# Altium schematic sheet 08_PowerConcept.SchDoc: -
size A3; Date: -; ApprovedBy: -; CheckedBy: -; Author: -; CompanyName: -; DrawnBy: -; Engineer: -; Organization: Komax AG; Address1: -; Address2: -; Address3: -; Address4: -; DocumentNumber: -; Revision: -; SheetNumber: 8; SheetTotal: 8; KSDP_ObjectName: Power Concept; KSDP_CreatedBy: Patrick Rossacher; KSDP_CreationDate: 14.11.2018; KSDP_ModificationDate: -; KSDP_ModifiedBy: -; CurrentTime: -; CurrentDate: -; Time: -; DocumentFullPathAndName: -; DocumentName: -; ModifiedDate: -; ImagePath: -
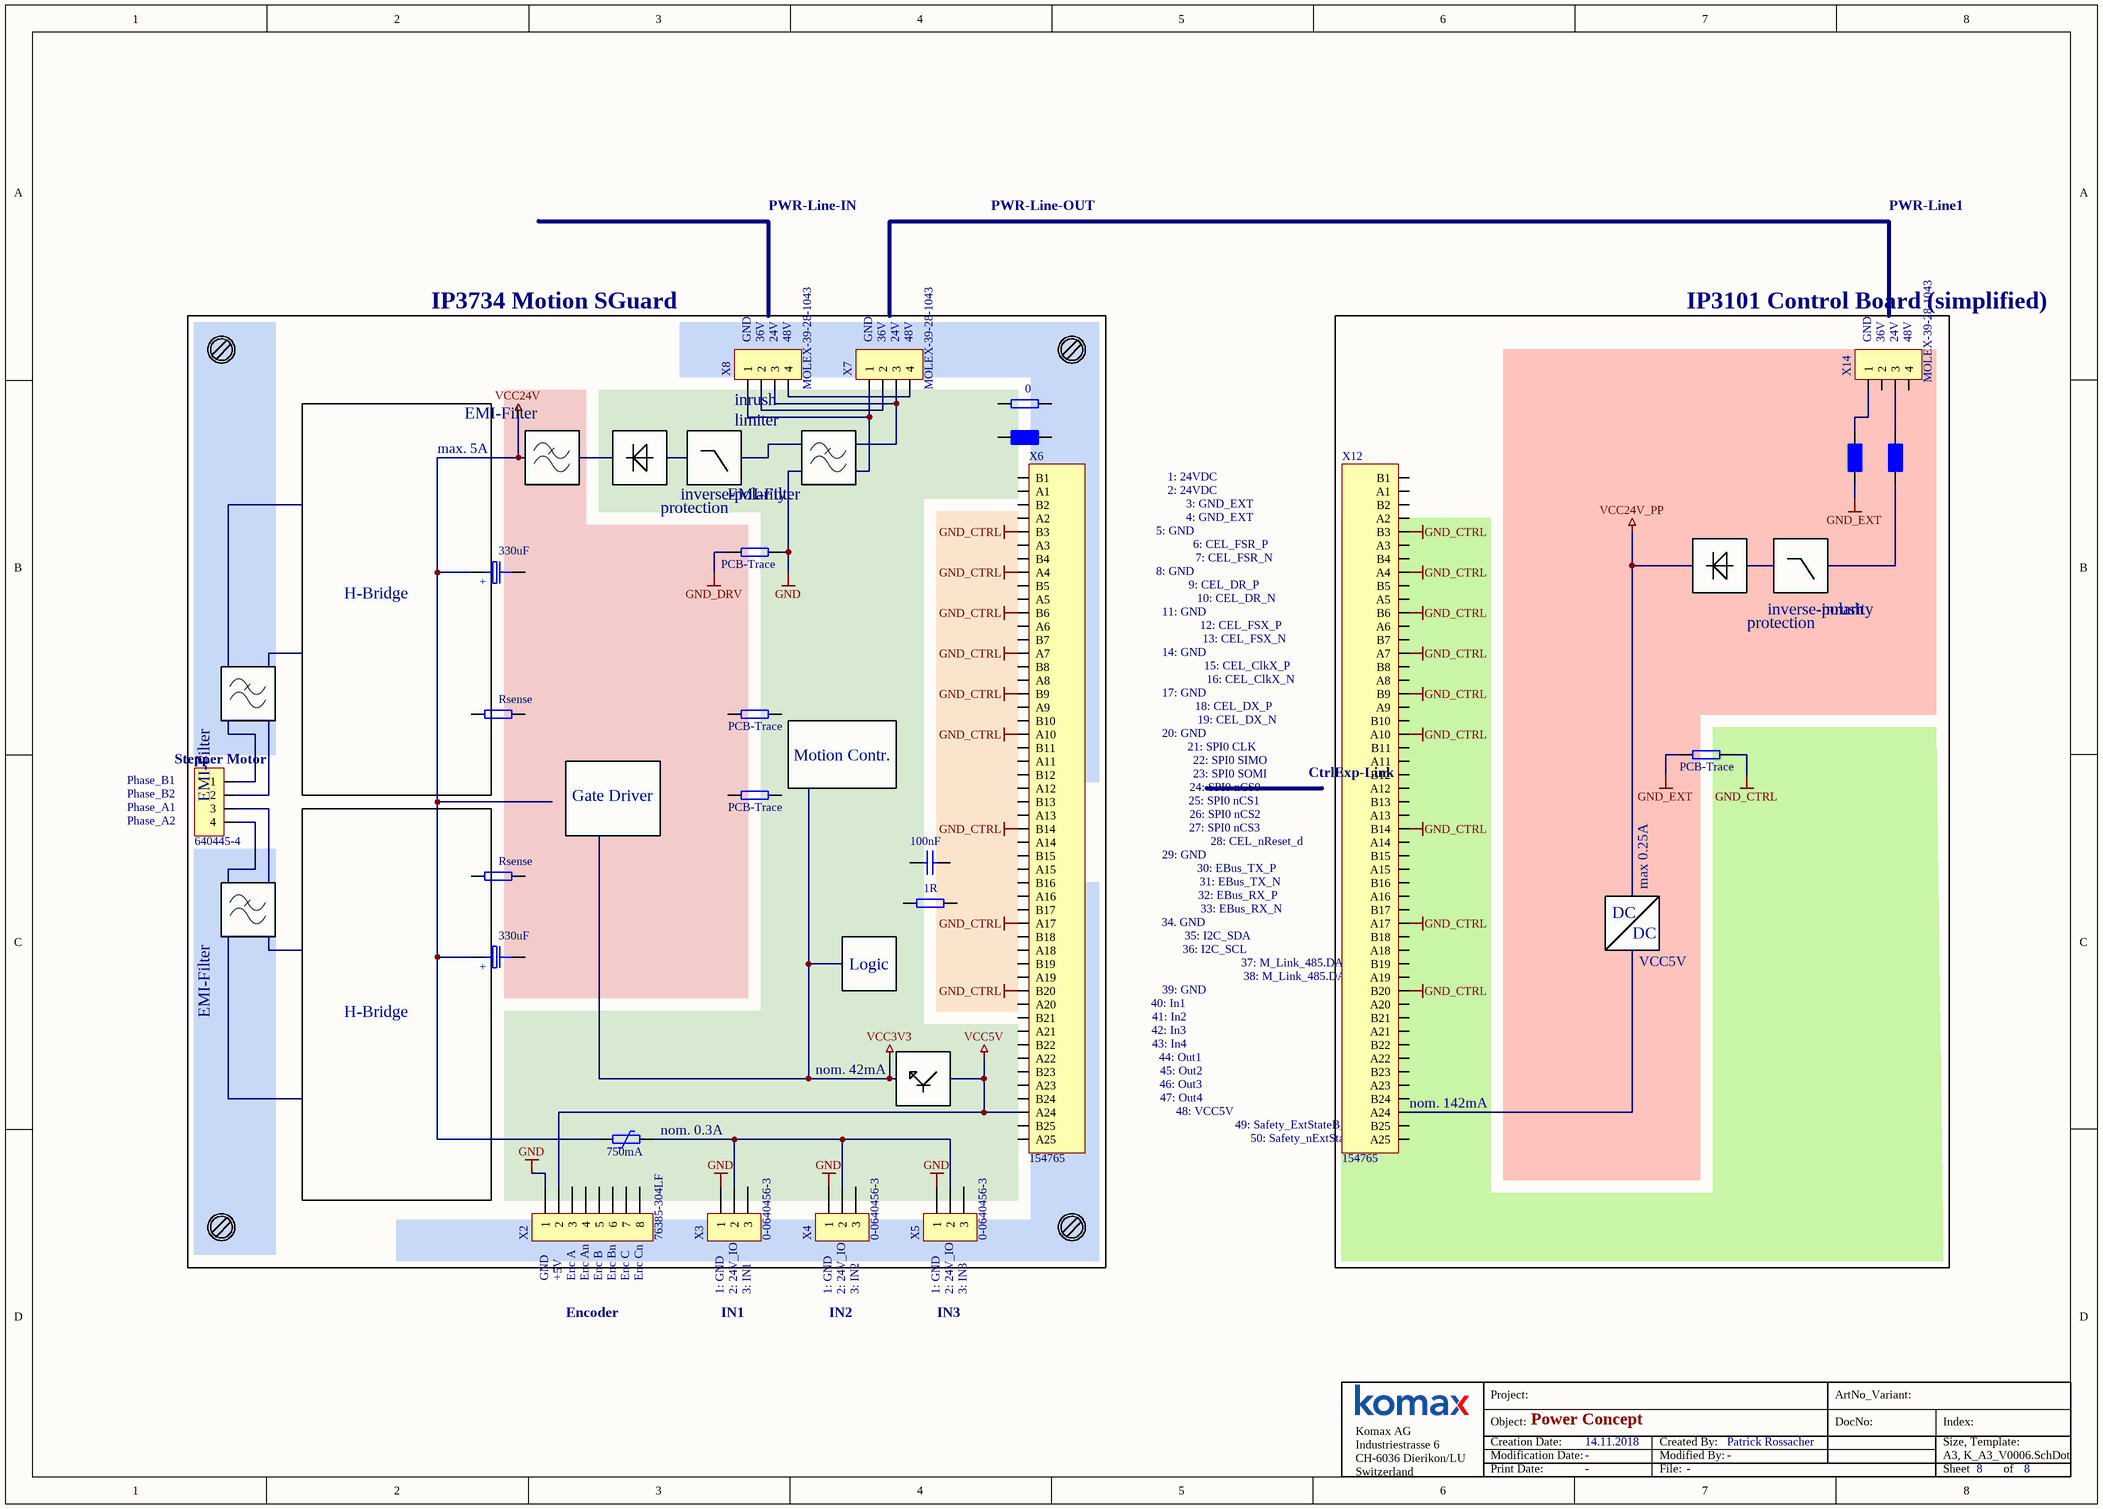
[diagram p0: 08_PowerConcept.SchDoc]

## Parts
(Parts that share a designator on the sheet are numbered #1, #2 ... from top to bottom, then left to right.)
C?#1  330uF  [SMD_Cap_Panasonic_H13]  (graphical)
C?#2  100nF  [0805_C]  (graphical)
C?#3  330uF  [SMD_Cap_Panasonic_H13]  (graphical)
F?  750mA  [1210_L]  (graphical)
L305  28F0181-1SR-10  [Laird 28F0181]  (value not drawn)  (graphical)
L308  28F0181-1SR-10  [Laird 28F0181]  (value not drawn)  (graphical)
L?  CIS21J121NE  [0805_R]  (value not drawn)  (graphical)
R?#1  0  [0805_R]  (graphical)
R?#2  PCB-Trace  [NET-CONNECT6]  (graphical)
R?#3  Rsense  [NET-CONNECT6]  (graphical)
R?#4  PCB-Trace  [NET-CONNECT6]  (graphical)
R?#5  PCB-Trace  [NET-CONNECT6]  (graphical)
R?#6  PCB-Trace  [NET-CONNECT6]  (graphical)
R?#7  Rsense  [NET-CONNECT6]  (graphical)
R?#8  1R  [0805_R]  (graphical)
X1  640445-4  [CON_THT_4P_MTA-156]  (graphical)
X2  76385-304LF  [CON_THT_FCI_76_385-304-LF]  (graphical)
X3  0-0640456-3  [CON_THT_3P_MTA-100]  (graphical)
X4  0-0640456-3  [CON_THT_3P_MTA-100]  (graphical)
X5  0-0640456-3  [CON_THT_3P_MTA-100]  (graphical)
X6  154765  [CON_SMD_50P_ERNI_154765]  (graphical)
X7  MOLEX-39-28-1043  [MOLEX-Minifit_4P_90_180deg]  (graphical)
X8  MOLEX-39-28-1043  [MOLEX-Minifit_4P_90_180deg]  (graphical)
X12  154765  [CON_SMD_50P_ERNI_154765]  (graphical)
X14  MOLEX-39-28-1043  [MOLEX-Minifit_4P_90_180deg]  (graphical)

## Blocks framed on the sheet
IP3734 Motion SGuard: C?#1-C?#3 F? L? R?#1-R?#4 R?#6-R?#8 X1-X8
IP3101 Control Board (simplified): L305 L308 R?#5 X14
nom. 142mA: X12

## Nets
GND: R?#2.1 X2.1 X3.1 X4.1 X5.1
GND_CTRL: R?#5.1 X6.A4 X6.A7 X6.A10 X6.A17 X6.B3 X6.B6 X6.B9 X6.B14 X6.B20 X12.A4 X12.A7 X12.A10 X12.A17 X12.B3 X12.B6 X12.B9 X12.B14 X12.B20
GND_DRV: R?#2.2
GND_EXT: L308.2 R?#5.2
VCC5V: X2.2 X6.A24
VCC24V: C?#1.1 C?#3.1 F?.1
NetF?_2: F?.2 X3.2 X4.2 X5.2
NetL305_1: L305.1 X14.3
NetL308_1: L308.1 X14.1
NetX7_1: X7.1 X8.1
NetX7_2: X7.2 X8.2
NetX7_3: X7.3 X8.3
NetX7_4: X7.4 X8.4

Not connected (* = marked no-connect by the designer): C?#1 2; C?#2 1 2; C?#3 2; L305 2; L? 1 2; R?#1 1 2; R?#3 1 2; R?#4 1 2; R?#6 1 2; R?#7 1 2; R?#8 1 2; X1 1 2 3 4; X2 3 4 5 6 7 8; X3 3; X4 3; X5 3; X6 A1 A2 A3 A5 A6 A8 A9 A11 A12 A13 A14 A15 A16 A18 A19 A20 A21 A22 A23 A25 B1 B2 B4 B5 B7 B8 B10 B11 B12 B13 B15 B16 B17 B18 B19 B21 B22 B23 B24 B25; X12 A1 A2 A3 A5 A6 A8 A9 A11 A12 A13 A14 A15 A16 A18 A19 A20 A21 A22 A23 A24 A25 B1 B2 B4 B5 B7 B8 B10 B11 B12 B13 B15 B16 B17 B18 B19 B21 B22 B23 B24 B25; X14 2 4

## Notes on the sheet
- PWR-Line-IN
- PWR-Line-OUT
- PWR-Line1
- (near X8) GND
- (near X8) 36V
- (near X8) 24V
- (near X8) 48V
- (near X7) GND
- (near X7) 36V
- (near X7) 24V
- (near X7) 48V
- (near X14) GND
- (near X14) 36V
- (near X14) 24V
- (near X14) 48V
- max. 5A
- EMI-Filter
- (near X8) inrush
- (near X8) limiter
- protection
- inverse-polarity
- 1: 24VDC
- 2: 24VDC
- 3: GND_EXT
- H-Bridge
- 5: GND
- 8: GND
- 4: GND_EXT
- 9: CEL_DR_P
- 6: CEL_FSR_P
- 7: CEL_FSR_N
- 11: GND
- 10: CEL_DR_N
- 12: CEL_FSX_P
- 13: CEL_FSX_N
- inrush
- 14: GND
- 17: GND
- 18: CEL_DX_P
- 19: CEL_DX_N
- 15: CEL_ClkX_P
- 16: CEL_ClkX_N
- (near X1) Phase_B1
- (near X1) Stepper Motor
- (near R?#6) Motion Contr.
- 20: GND
- 21: SPI0 CLK
- 22: SPI0 SIMO
- 23: SPI0 SOMI
- CtrlExp-Link
- (near X1) Phase_B2
- (near X1) Phase_A1
- (near X1) Phase_A2
- Gate Driver
- 29: GND
- 25: SPI0 nCS1
- 27: SPI0 nCS3
- 26: SPI0 nCS2
- 24: SPI0 nCS0
- 28: CEL_nReset_d
- Filter
- 30: EBus_TX_P
- 32: EBus_RX_P
- 31: EBus_TX_N
- 33: EBus_RX_N
- DC
- max 0.25A
- (near X1) EMI-Filter
- Logic
- 34. GND
- 39: GND
- 36: I2C_SCL
- 35: I2C_SDA
- 37: M_Link_485.DAT_P
- 38: M_Link_485.DAT_N
- VCC5V
- 40: In1
- 42: In3
- 41: In2
- 43: In4
- nom. 42mA
- 44: Out1
- 46: Out3
- 45: Out2
- 47: Out4
- 48: VCC5V
- 49: Safety_ExtStateB_d
- (near F?) nom. 0.3A
- 50: Safety_nExtStateFB_A
- (near X2) GND
- Encoder
- (near X2) +5V
- (near X2) Enc A
- (near X2) Enc An
- (near X2) Enc B
- (near X2) Enc Bn
- (near X2) Enc C
- (near X2) Enc Cn
- IN1
- (near X3) 1: GND
- (near X3) 2: 24V_IO
- (near X3) 3: IN1
- IN2
- (near X4) 1: GND
- (near X4) 2: 24V_IO
- (near X4) 3: IN2
- IN3
- (near X5) 1: GND
- (near X5) 2: 24V_IO
- (near X5) 3: IN3
- Project:
- ArtNo_Variant:
- Object:
- Creation Date:
- Modification Date:
- Created By:
- Modified By:
- DocNo:
- Index:
- Size, Template:
- A3, K_A3_V0006.SchDot
- Komax AG
  Industriestrasse 6
  CH-6036 Dierikon/LU
  Switzerland
- Print Date:
- File:
- Sheet
- of
- (in symbol C_EL_220UF/50V) +

## Library data of the parts
C?#1 C?#3 = C_EL_220UF/50V: EEVFK1H331Q; Manufacturer: Panasonic; Spannung: 50V; Strategic: 0; Bezeichnung: EEVFK1H331Q
C?#2 = Cap: Ceramic Capacitor >=50V X7R; FootprintBOM: 0805
F? = THERMAL FUSE_1: Polyfuse 750mA; Manufacturer: Littlefuse; MaxTemp: +85; MinTemp: -40; FootprintBOM: 1210
L305 L308 = INDUCTOR1: SMD Ferrit  115hm @ 100MHz 10A; Manufacturer: Laird; Distributor: Digikey; FootprintBOM: SMD
L? = INDUCTOR1: Power Supression Bead 120Ohm bei 100MHz 5A; Manufacturer: Samsung; FootprintBOM: 0805
R?#1 R?#8 = RES2: Resistor 0.125W 1%; FootprintBOM: 0805
R?#2-R?#7 = RES2: Circuit Path; FootprintBOM: -
X1 = CON_4P: MTA-156 Plug Connector 180° 4P 3.96mm
X2 = CON8: Header 2x4p 180° RM=2.54mm; Manufacturer: FCI Framatone; FootprintBOM: THT
X3-X5 = CON3: MTA-100 Plug Connector 180° 3p 2.54mm; Manufacturer: AMP/TYCO; MaxTemp: +105; MinTemp: -25; FootprintBOM: THT RM=2.54mm
X6 X12 = CON_50P_ERNI: Connector SMC 2x25p 90° 1.27mm; Manufacturer: ERNI; Bemerkung: 13.65mm Bauhöhe; MaxTemp: 125; MinTemp: -55; 2ndSource: 15 15 050 5601 333 / Harting; 3rdSource: *; Distributor: *; FootprintBOM: SMD RM=1.27mm; Notes: *; Reference: *; Strategic: *
X7 X8 X14 = CON_4P: Connector Mini Fit 4p 180°; Manufacturer: Molex; FootprintBOM: THT